# Altium schematic sheet DistanceSensor.SchDoc
size A4; SheetNumber: 8; SheetTotal: 15
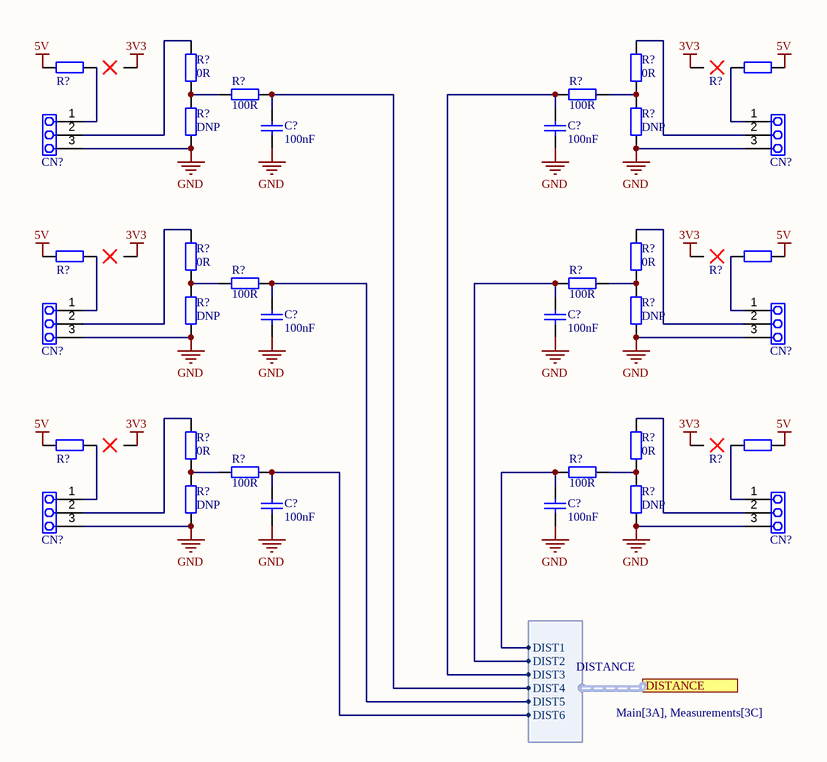
[diagram p0: DistanceSensor.SchDoc]

## Parts
(Parts that share a designator on the sheet are numbered #1, #2 ... from top to bottom, then left to right.)
C?#1  100nF  [CAP0603]
C?#2  100nF  [CAP0603]
C?#3  100nF  [CAP0603]
C?#4  100nF  [CAP0603]
C?#5  100nF  [CAP0603]
C?#6  100nF  [CAP0603]
CN?#1  Pins 1x3  [PIN-1X3]  (value not drawn)
CN?#2  Pins 1x3  [PIN-1X3]  (value not drawn)
CN?#3  Pins 1x3  [PIN-1X3]  (value not drawn)
CN?#4  Pins 1x3  [PIN-1X3]  (value not drawn)
CN?#5  Pins 1x3  [PIN-1X3]  (value not drawn)
CN?#6  Pins 1x3  [PIN-1X3]  (value not drawn)
R?#1  *  [RES0603 _SELECTION]  (value not drawn)
R?#2  *  [RES0603 _SELECTION]  (value not drawn)
R?#3  0R  [RES0603]
R?#4  100R  [RES0603]
R?#5  100R  [RES0603]
R?#6  0R  [RES0603]
R?#7  DNP  [RES0603]  (no BOM)
R?#8  DNP  [RES0603]  (no BOM)
R?#9  *  [RES0603 _SELECTION]  (value not drawn)
R?#10  *  [RES0603 _SELECTION]  (value not drawn)
R?#11  0R  [RES0603]
R?#12  100R  [RES0603]
R?#13  100R  [RES0603]
R?#14  0R  [RES0603]
R?#15  DNP  [RES0603]  (no BOM)
R?#16  DNP  [RES0603]  (no BOM)
R?#17  *  [RES0603 _SELECTION]  (value not drawn)
R?#18  *  [RES0603 _SELECTION]  (value not drawn)
R?#19  0R  [RES0603]
R?#20  100R  [RES0603]
R?#21  100R  [RES0603]
R?#22  0R  [RES0603]
R?#23  DNP  [RES0603]  (no BOM)
R?#24  DNP  [RES0603]  (no BOM)

## Ports
DISTANCE (harness DISTANCE, see Main[3A], Measurements[3C])

## Harnesses
DISTANCE: DIST1, DIST2, DIST3, DIST4, DIST5, DIST6

## Nets
3V3: R?#1.3 R?#2.3 R?#9.3 R?#10.3 R?#17.3 R?#18.3
5V: R?#1.1 R?#2.1 R?#9.1 R?#10.1 R?#17.1 R?#18.1
GND: C?#1.1 C?#2.1 C?#3.1 C?#4.1 C?#5.1 C?#6.1 CN?#1.3 CN?#2.3 CN?#3.3 CN?#4.3 CN?#5.3 CN?#6.3 R?#7.1 R?#8.1 R?#15.1 R?#16.1 R?#23.1 R?#24.1
NetC?#1_2: C?#1.2 R?#4.2 ; port DISTANCE.DIST4
NetC?#2_2: C?#2.2 R?#5.2 ; port DISTANCE.DIST3
NetC?#3_2: C?#3.2 R?#12.2 ; port DISTANCE.DIST5
NetC?#4_2: C?#4.2 R?#13.2 ; port DISTANCE.DIST2
NetC?#5_2: C?#5.2 R?#20.2 ; port DISTANCE.DIST6
NetC?#6_2: C?#6.2 R?#21.2 ; port DISTANCE.DIST1
NetCN?#1_1: CN?#1.1 R?#1.2
NetCN?#1_2: CN?#1.2 R?#3.2
NetCN?#2_1: CN?#2.1 R?#2.2
NetCN?#2_2: CN?#2.2 R?#6.2
NetCN?#3_1: CN?#3.1 R?#9.2
NetCN?#3_2: CN?#3.2 R?#11.2
NetCN?#4_1: CN?#4.1 R?#10.2
NetCN?#4_2: CN?#4.2 R?#14.2
NetCN?#5_1: CN?#5.1 R?#17.2
NetCN?#5_2: CN?#5.2 R?#19.2
NetCN?#6_1: CN?#6.1 R?#18.2
NetCN?#6_2: CN?#6.2 R?#22.2
NetR?#3_1: R?#3.1 R?#4.1 R?#7.2
NetR?#5_1: R?#5.1 R?#6.1 R?#8.2
NetR?#11_1: R?#11.1 R?#12.1 R?#15.2
NetR?#13_1: R?#13.1 R?#14.1 R?#16.2
NetR?#19_1: R?#19.1 R?#20.1 R?#23.2
NetR?#21_1: R?#21.1 R?#22.1 R?#24.2

## Notes on the sheet
- Size
- Date
- A4
- Title
- Sheet number
- Author
- Revision

## Library data of the parts
C?#1-C?#6 = Capacitor: Voltage: *; Value: 100nF
CN?#1-CN?#6 = Pins 1x3: 1x3 2.54mm; Part Class: Connector; Order Code: 855-M50-3530342; CompType: M50-3530342; Distributor: Mouser; Package: SMD 1.27mm
R?#1 R?#2 R?#9 R?#10 R?#17 R?#18 = Resistor_Selection: Resistor; Value: *
R?#3-R?#8 R?#11-R?#16 R?#19-R?#24 = Resistor
  R?#3 R?#6 R?#11 R?#14 R?#19 R?#22: Value: 0R
  R?#4 R?#5 R?#12 R?#13 R?#20 R?#21: Value: 100R
  R?#7 R?#8 R?#15 R?#16 R?#23 R?#24: Value: DNP